# Altium schematic sheet Sheet1.SchDoc
size A4; SheetNumber: 1; SheetTotal: 1
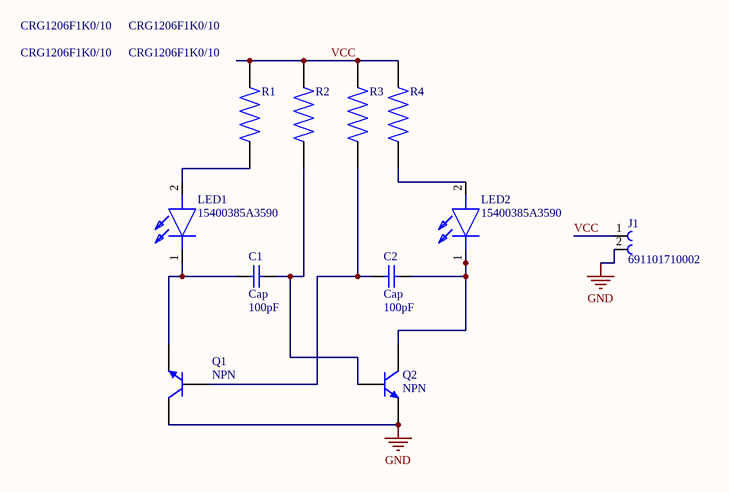
[diagram p0: Sheet1.SchDoc]

## Parts
C1  Cap  value 100pF  [RAD-0.3]
C2  Cap  value 100pF  [RAD-0.3]
J1  691101710002  [691101710002]
LED1  15400385A3590  [15400385A3590]
LED2  15400385A3590  [15400385A3590]
Q1  NPN  [TO-226-AA]
Q2  NPN  [TO-226-AA]
R1  CRG1206F1K0/10  [RESC3115X65N]
R2  CRG1206F1K0/10  [RESC3115X65N]
R3  CRG1206F1K0/10  [RESC3115X65N]
R4  CRG1206F1K0/10  [RESC3115X65N]

## Nets
GND: J1.2 Q1.1(C) Q2.3(E)
VCC: J1.1 R1.2 R2.2 R3.2 R4.2
NetC1_1: C1.1 LED1.1(K) Q1.3(E)
NetC1_2: C1.2 Q2.2(B) R2.1
NetC2_1: C2.1 Q1.2(B) R3.1
NetC2_2: C2.2 LED2.1(K) Q2.1(C)
NetLED1_2: LED1.2(A) R1.1
NetLED2_2: LED2.2(A) R4.1

## Library data of the parts
C1 C2 = Cap: Capacitor; Published: 8-Jun-2000; LatestRevisionDate: 17-Jul-2002; LatestRevisionNote: Re-released for DXP Platform.; PackageReference: RAD-0.3; Publisher: Altium Limited; PackageDescription: Radial Cap, Thru-Hole; 2 Leads; 0.3 in Pin Spacing
J1 = 691101710002: 2 Position Wire to Board Terminal Block Horizontal with Board 0.197 (5.00mm) Through Hole; MF: WÃ¼rth Elektronik; Price: None; Purchase-URL: https://pricing.snapeda.com/search/part/691101710002/?ref=eda; Value: *; Check_prices: https://www.snapeda.com/parts/691101710002/Wurth+Elektronik/view-part/?ref=eda; Package: None; SnapEDA_Link: https://www.snapeda.com/parts/691101710002/Wurth+Elektronik/view-part/?ref=snap; MP: 691101710002; Availability: In Stock
LED1 LED2 = 15400385A3590: LED; Manufacturer_Name: Wurth Elektronik; Datasheet Link: https://www.we-online.com/katalog/datasheet/15400385A3590.pdf; Height: 10.9mm; Manufacturer_Part_Number: 15400385A3590; Mouser Part Number: 710-15400385A3590; Mouser Price/Stock: https://www.mouser.co.uk/ProductDetail/Wurth-Elektronik/15400385A3590?qs=5aG0NVq1C4yszs1ddn0oOg%3D%3D
Q1 Q2 = NPN: NPN Bipolar Transistor; Published: 8-Jun-2000; LatestRevisionDate: 17-Jul-2002; LatestRevisionNote: Re-released for DXP Platform.; PackageReference: TO-226-AA; Publisher: Altium Limited; PackageDescription: TO, Flat Index; 3 In-Line, Axial Leads; Body Dia. 4.8mm; Leads 0.55 x 0.51 mm (max); Code_JEDEC: TO-226-AA
R1-R4 = CRG1206F1K0/10: Res KalÄ±n Film 1206 1K Ohm 1% 1 / 4W Â± 100ppm / Â° C KalÄ±plÄ± SMD SMD; Voltage_Rating: 200 V; Power_Rating: .25 W; MF: TE Connectivity; Tolerance: 1%; SnapEDA_Link: https://www.snapeda.com/parts/CRG1206F1K0/10/TE%20Connectivity%20Passive%20Product/view-part/981079/?ref=snap; Price: None; Purchase-URL: https://pricing.snapeda.com/search/part/CRG1206F1K0/10/?ref=eda; Resistance: 1K; EU_RoHS_Compliance: Compliant with Exemptions; MP: CRG1206F1K0/10; Value: *; Availability: Warning; Package: 1206